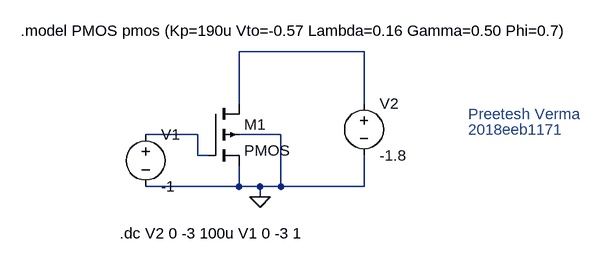
[diagram p0: schematic Pmos.asc]
Pmos.asc, the LTspice schematic file:
Version 4
SHEET 1 880 680
WIRE 368 32 176 32
WIRE 176 112 176 32
WIRE 368 112 368 32
WIRE 112 160 32 160
WIRE 240 160 176 160
WIRE 112 192 112 160
WIRE 128 192 112 192
WIRE 176 240 176 208
WIRE 176 240 32 240
WIRE 208 240 176 240
WIRE 240 240 240 160
WIRE 240 240 208 240
WIRE 368 240 368 192
WIRE 368 240 240 240
WIRE 208 256 208 240
FLAG 208 256 0
SYMBOL pmos4 128 112 R0
SYMATTR InstName M1
SYMBOL voltage 32 144 R0
WINDOW 123 0 0 Left 0
WINDOW 39 0 0 Left 0
SYMATTR InstName V1
SYMATTR Value -1
SYMBOL voltage 368 96 R0
WINDOW 123 0 0 Left 0
WINDOW 39 0 0 Left 0
SYMATTR InstName V2
SYMATTR Value -1.8
TEXT -160 0 Left 2 !.model PMOS pmos (Kp=190u Vto=-0.57 Lambda=0.16 Gamma=0.50 Phi=0.7)
TEXT -8 312 Left 2 !.dc V2 0 -3 100u V1 0 -3 1
TEXT 528 128 Left 2 ;Preetesh Verma
TEXT 528 152 Left 2 ;2018eeb1171

The netlist it stands for:
* Pmos.asc
M1 N001 N002 0 0 PMOS
V1 N002 0 -1
V2 N001 0 -1.8
.model NMOS NMOS
.model PMOS PMOS
.lib standard.mos
.model PMOS pmos (Kp=190u Vto=-0.57 Lambda=0.16 Gamma=0.50 Phi=0.7)
.dc V2 0 -3 100u V1 0 -3 1
* Preetesh Verma
* 2018eeb1171
.backanno
.end